# Altium project lab2_kozlov_buck_boost.PrjPcb
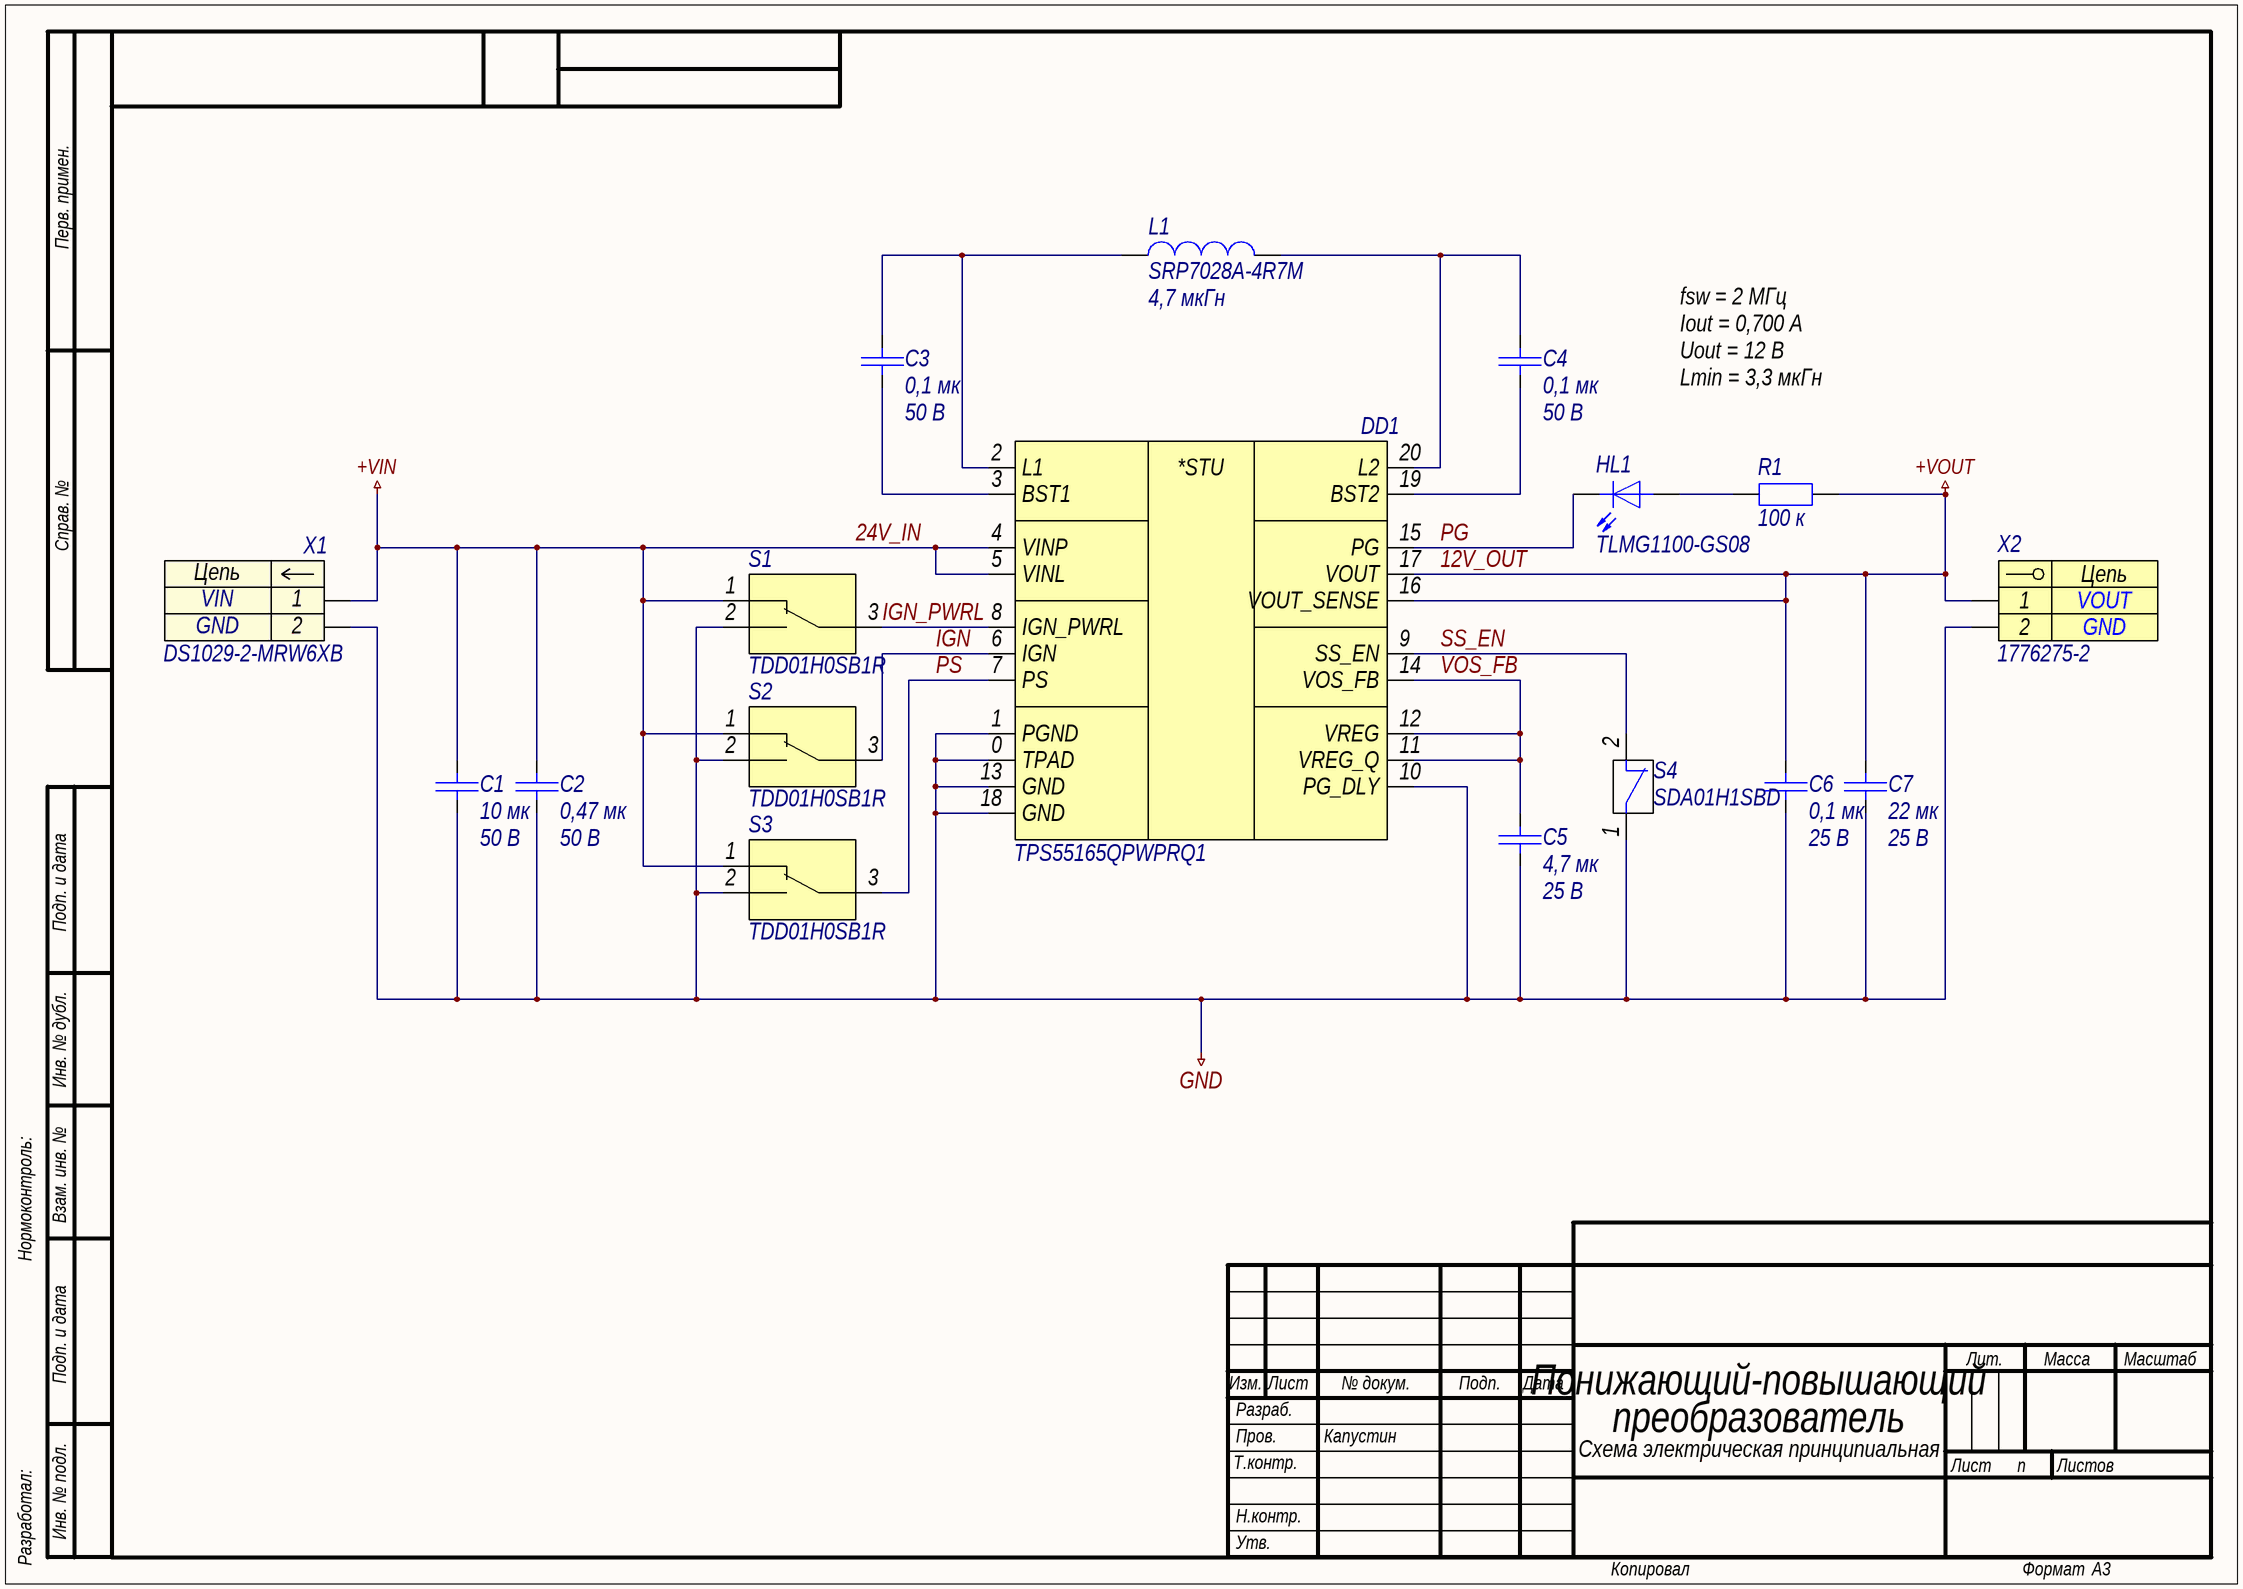
[diagram p0: lab2_kozlov_buck_boost.SchDoc]
approver: Капустин; check: Капустин; designation: СПБПУ.3331506.09; developer: Козлов; document_code: Ý3; document_type: Схема электрическая принципиальная; pcb_dec_number: СПБПУ.3331506.09; project: lab2_kozlov_buck_boost; sheets_total: 1; title: Понижающий-повышающий преобразователь; title_line_1: Понижающий-повышающий; title_line_2: преобразователь
1 sheet, 17 parts. Net scope: global (net labels, ports and power ports of the same name join across sheets).
Board file: lab2_kozlov_buck_boost.PcbDoc

## Sheet lab2_kozlov_buck_boost.SchDoc: Понижающий-повышающий преобразователь
size 420 x 297 mm; ApprovedBy: Капустин; CheckedBy: Капустин; DrawnBy: Козлов; DocumentNumber: СПБПУ.3331506.09Ý3; SheetNumber: n; SheetTotal: 1; DocumentCode: Ý3; ImagePath: СПБПУ.3331506.09

### Parts
C1  10 мк  Напряжение: 50 В  [C0805]
C2  0,47 мк  Напряжение: 50 В  [C0603]
C3  0,1 мк  Напряжение: 50 В  [C0603]
C4  0,1 мк  Напряжение: 50 В  [C0603]
C5  4,7 мк  Напряжение: 25 В  [C0603]
C6  0,1 мк  Напряжение: 25 В  [C0402]
C7  22 мк  Напряжение: 25 В  [C1206]
DD1  TPS55165QPWPRQ1  [HTSSOP-20]
HL1  TLMG1100-GS08  [HL0603]
L1  SRP7028A-4R7M  Индуктивность: 4,7 мкГн  [SRP-2-730X660X280]
R1  100 к  [R0603]
S1  TDD01H0SB1R  [TDD01H0SB1R]
S2  TDD01H0SB1R  [TDD01H0SB1R]
S3  TDD01H0SB1R  [TDD01H0SB1R]
S4  SDA01H1SBD  [SDA01H1SBD]
X1  DS1029-2-MRW6XB  [DS1029-2-MRW6XB]
X2  1776275-2  [1776275-2]

### Nets
12V_OUT: C6.1 C7.1 DD1.16(VOUT_SENSE) DD1.17(VOUT) R1.2 X2.1  [also labelled +VOUT]
24V_IN: C1.1 C2.1 DD1.4(VINP) DD1.5(VINL) S1.1 S2.1 S3.1 X1.1  [also labelled +VIN]
GND: C1.2 C2.2 C5.2 C6.2 C7.2 DD1.0(TPAD) DD1.1(PGND) DD1.10(PG_DLY) DD1.13(GND) DD1.18(GND) S1.2 S2.2 S3.2 S4.1 X1.2 X2.2
IGN: DD1.6(IGN) S2.3
IGN_PWRL: DD1.8(IGN_PWRL) S1.3
PG: DD1.15(PG) HL1.1
PS: DD1.7(PS) S3.3
SS_EN: DD1.9(SS_EN) S4.2
VOS_FB: C5.1 DD1.11(VREG_Q) DD1.12(VREG) DD1.14(VOS_FB)
NetC3_1: C3.1 DD1.2(L1) L1.1
NetC3_2: C3.2 DD1.3(BST1)
NetC4_1: C4.1 DD1.20(L2) L1.2
NetC4_2: C4.2 DD1.19(BST2)
NetHL1_2: HL1.2 R1.1

### Notes on the sheet
- fsw = 2 МГц
  Iout = 0,700 А
  Uout = 12 В
  Lmin = 3,3 мкГн
- Перв. примен.
- Справ. №
- Подп. и дата
- Инв. № дубл.
- Нормоконтроль:
- Взам. инв. №
- Изм.
- Лист
- № докум.
- Подп.
- Дата
- Лит.
- Масса
- Масштаб
- Т.контр.
- Пров.
- Разраб.
- Листов
- Разработал:
- Инв. № подл.
- Н.контр.
- Утв.
- Копировал
- Формат
- А3
- (in symbol dd0013) *STU
- (in symbol x0005) Цепь
- (in symbol x0007) Цепь

### Library data of the parts
C1 = c0091: =Описание; ID: c0091; Фамилия: Паньков; Описание: Конденсатор чип 0805 10 мкФ 50 В ±10 %; Наименование: CC0805KRX5R9BB106; Производитель: YAGEO Corp.; Отклонение: ±10 %; Рабочие температуры: от –55 °С до +85 °С; Температурный коэффициент емкости: X5R; Корпус: 0805; Номинал: 10 мк; Номинальное напряжение: 50 В; HelpURL: https://www.yageo.com/upload/media/product/productsearch/datasheet/mlcc/UPY-GPHC_X5R_4V-to-50V_26.pdf
C2 = c0052: =Описание; ID: c0052; Фамилия: Паньков; Описание: Конденсатор чип 0603 470 нФ 50 В ±10 %; Наименование: CC0603KRX5R9BB474; Производитель: YAGEO Corp.; Отклонение: ±10 %; Рабочие температуры: от –55 °С до +85 °С; Температурный коэффициент емкости: X5R; Корпус: 0603; Номинал: 0,47 мк; Номинальное напряжение: 50 В; HelpURL: https://www.yageo.com/upload/media/product/productsearch/datasheet/mlcc/UPY-GPHC_X5R_4V-to-50V_26.pdf
C3 C4 = c0034: =Описание; ID: c0034; Фамилия: Ларионов; Описание: Конденсатор чип 0603 100 нФ 50 В ±5 %; Наименование: CC0603JRX7R9BB104; Производитель: YAGEO Corp.; Отклонение: ±5 %; Рабочие температуры: от –55 °С до +125 °С; Температурный коэффициент емкости: X7R; Корпус: 0603; Номинал: 0,1 мк; Номинальное напряжение: 50 В; HelpURL: https://www.yageo.com/upload/media/product/products/datasheet/mlcc/UPY-GPHC_X7R_6.3V-to-50V_20.pdf
C5 = c0080: =Описание; ID: c0080; Фамилия: Ларионов; Описание: Конденсатор чип 0603 4,7 мкФ 25 В ±10 %; Наименование: CC0603KRX5R8BB475; Производитель: YAGEO Corp.; Отклонение: ±10 %; Рабочие температуры: от –55 °С до +85 °С; Температурный коэффициент емкости: X5R; Корпус: 0603; Номинал: 4,7 мк; Номинальное напряжение: 25 В; HelpURL: https://www.yageo.com/upload/media/product/productsearch/datasheet/mlcc/UPY-GPHC_X5R_4V-to-50V_26.pdf
C6 = c0029: =Описание; ID: c0029; Фамилия: Паньков; Описание: Конденсатор чип 0402 100 нФ 25 В ±10 %; Наименование: CC0402KRX5R8BB104; Производитель: YAGEO Corp.; Отклонение: ±10 %; Рабочие температуры: от –55 °С до +85 °С; Температурный коэффициент емкости: X5R; Корпус: 0402; Номинал: 0,1 мк; Номинальное напряжение: 25 В; HelpURL: https://www.yageo.com/upload/media/product/productsearch/datasheet/mlcc/UPY-GPHC_X5R_4V-to-50V_26.pdf
C7 = c0105: =Описание; ID: c0105; Фамилия: Паньков; Описание: Конденсатор чип 1206 22 мкФ 25 В ±10 %; Наименование: CC1206KRX7R8BB226; Производитель: YAGEO Corp.; Отклонение: ±10 %; Рабочие температуры: от –55 °С до +125 °С; Температурный коэффициент емкости: X7R; Корпус: 1206; Номинал: 22 мк; Номинальное напряжение: 25 В; HelpURL: https://www.yageo.com/upload/media/product/productsearch/datasheet/mlcc/UPY-GPHC_X7R_6.3V-to-50V_20.pdf
DD1 = dd0013: =Описание; ID: dd0013; Фамилия: Козлов; Описание: Повышающий/понижающий преобразователь напряжения 36 В и 1 А; Производитель: Texas Instruments; Входное напряжение: от 2 В до 36 В; Выходное напряжение: 5 В/12 В; Коммутируемый ток: до 1 А; Частота переключения: 2 МГц; Рабочие температуры: от –40 °С до +125 °С; Наименование: TPS55165QPWPRQ1; Корпус: HTSSOP-20; HelpURL: https://www.ti.com/product/TPS55165-Q1
HL1 = hl0005: =Описание; ID: hl0005; Фамилия: Ларионов; Описание: Светодиод чип 0603 зеленый; Производитель: Vishay Intertechnology, Inc.; Цвет: Green; Номинальная сила света: 35 мкд; Номинальная длина волны: 570 нм; Номинальный прямой ток: 30 мА; Номинальное падение напряжения: 2,1 В; Рассеиваемая мощность: 90 мВт; Рабочие температуры: от –40 °С до +100 °С; Корпус: 0603; Наименование: TLMG1100-GS08; HelpURL: https://www.vishay.com/leds/list/product-83173/
L1 = l0004: =Описание; ID: l0004; Фамилия: Игнатова; Описание: Катушка индуктивности 4,7 мкГн ±20 %; Производитель: Bourns, Inc.; Отклонение: ±20 %; Номинальное активное сопротивление: 37 мОм; Максимальное активное сопротивление: 40 мОм; Резонансная частота: 21 МГц; Номинальный ток (при нагреве на 20 °С/40 °С): 5,5 А; Ток насыщения: 10 А; Рабочее напряжение: не указано; Рабочие температуры: от –55 °С до +150 °С; Корпус: 7,3 x 6,6 x 2,8; Наименование: SRP7028A-4R7M; Номинал: 4,7 мкГн; HelpURL: https://www.bourns.com/products/magnetic-products/power-inductors-aec-q200-compliant/product/SRP7028A
R1 = r0094: =Описание; ID: r0094; Фамилия: Водорезов; Описание: Резистор чип 0603 100 кОм ±1 % 0,1 Вт; Наименование: RC0603FR-07100KL; Производитель: YAGEO Corp.; Отклонение: ±1 %; Номинальное напряжение: 75 В; Рабочие температуры: от –55 °С до +155 °С; Номинальный ток: 1 А; Корпус: 0603; Номинал: 100 к; HelpURL: https://www.yageo.com/upload/media/product/productsearch/datasheet/rchip/PYu-RC_Group_51_RoHS_L_11.pdf
S1-S3 = s0005: =Описание; ID: s0005; Фамилия: Игнатова; Описание: 2-х позиционный движковый переключатель; Производитель: C&K; Ток нагрузки: 25 мА @ 24 В; Сопротивление контакта: 100 мОм; Количество контактов: 3; Рабочие температуры: от –35 °С до +85 °С; Промывка: Разрешена; Корпус: 6,00х4,20х2,30; Наименование: TDD01H0SB1R; HelpURL: https://www.ckswitches.com/products/switches/product-details/DIP/TDD/TDD01H0SB1R/
S4 = s0002: =Описание; ID: s0002; Фамилия: Паньков; Описание: 2-х позиционный движковый переключатель; Производитель: C&K; Ток нагрузки: 100 мА @ 5 В; Сопротивление контакта: 50 мОм; Количество контактов: 2; Рабочие температуры: от –40 °С до +85 °С; Промывка: Разрешена; Корпус: 4,52х9,30х5,45; Наименование: SDA01H1SBD; HelpURL: https://www.ckswitches.com/products/switches/product-details/DIP/SDA/SDA01H1SBD/
X1 = x0007: =Описание; Contact_1: VIN; Contact_2: GND; ID: x0007; Фамилия: Ларионов; Описание: CWF 2 pin Type B 2,5 мм вилка угловой; Производитель: Connfly Electronic Co. LTD.; Наименование: DS1029-2-MRW6XB; HelpURL: http://www.connfly.com/productshow.aspx?id=352
X2 = x0005: =Описание; Contact_1: VOUT; Contact_2: GND; ID: x0005; Фамилия: Паньков; Описание: Terminal Block 2 pin 3,5 мм; Производитель: TE Connectivity; Наименование: 1776275-2; HelpURL: https://www.te.com/usa-en/product-1776275-2.html